# Altium project WPTChargerMain.PrjPcb (part 3 of 3)

## Sheet 06-BatteryManagement.SchDoc: Battery Management
size A2
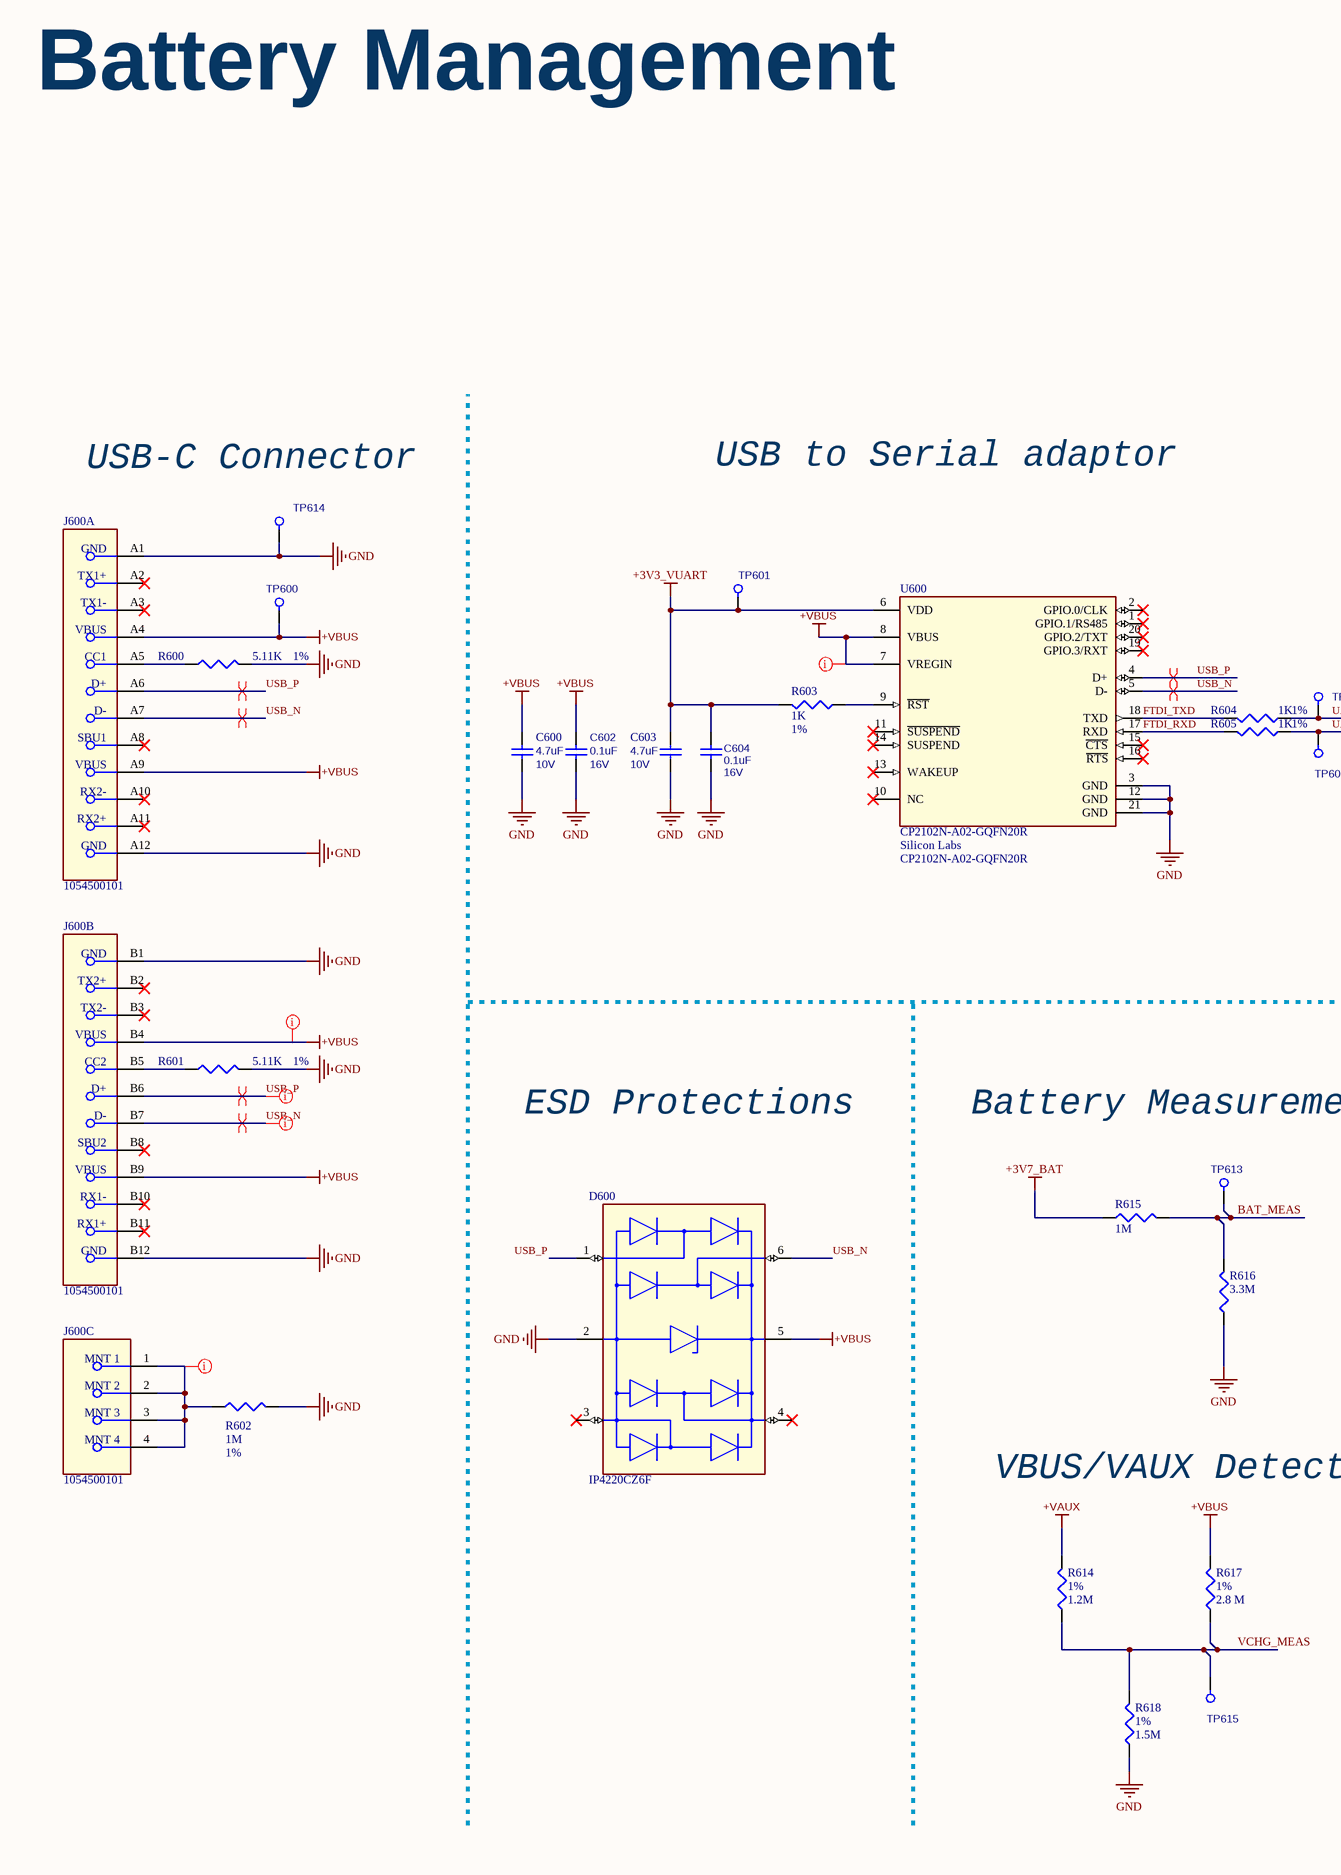
[diagram p6: 06-BatteryManagement.SchDoc, left]
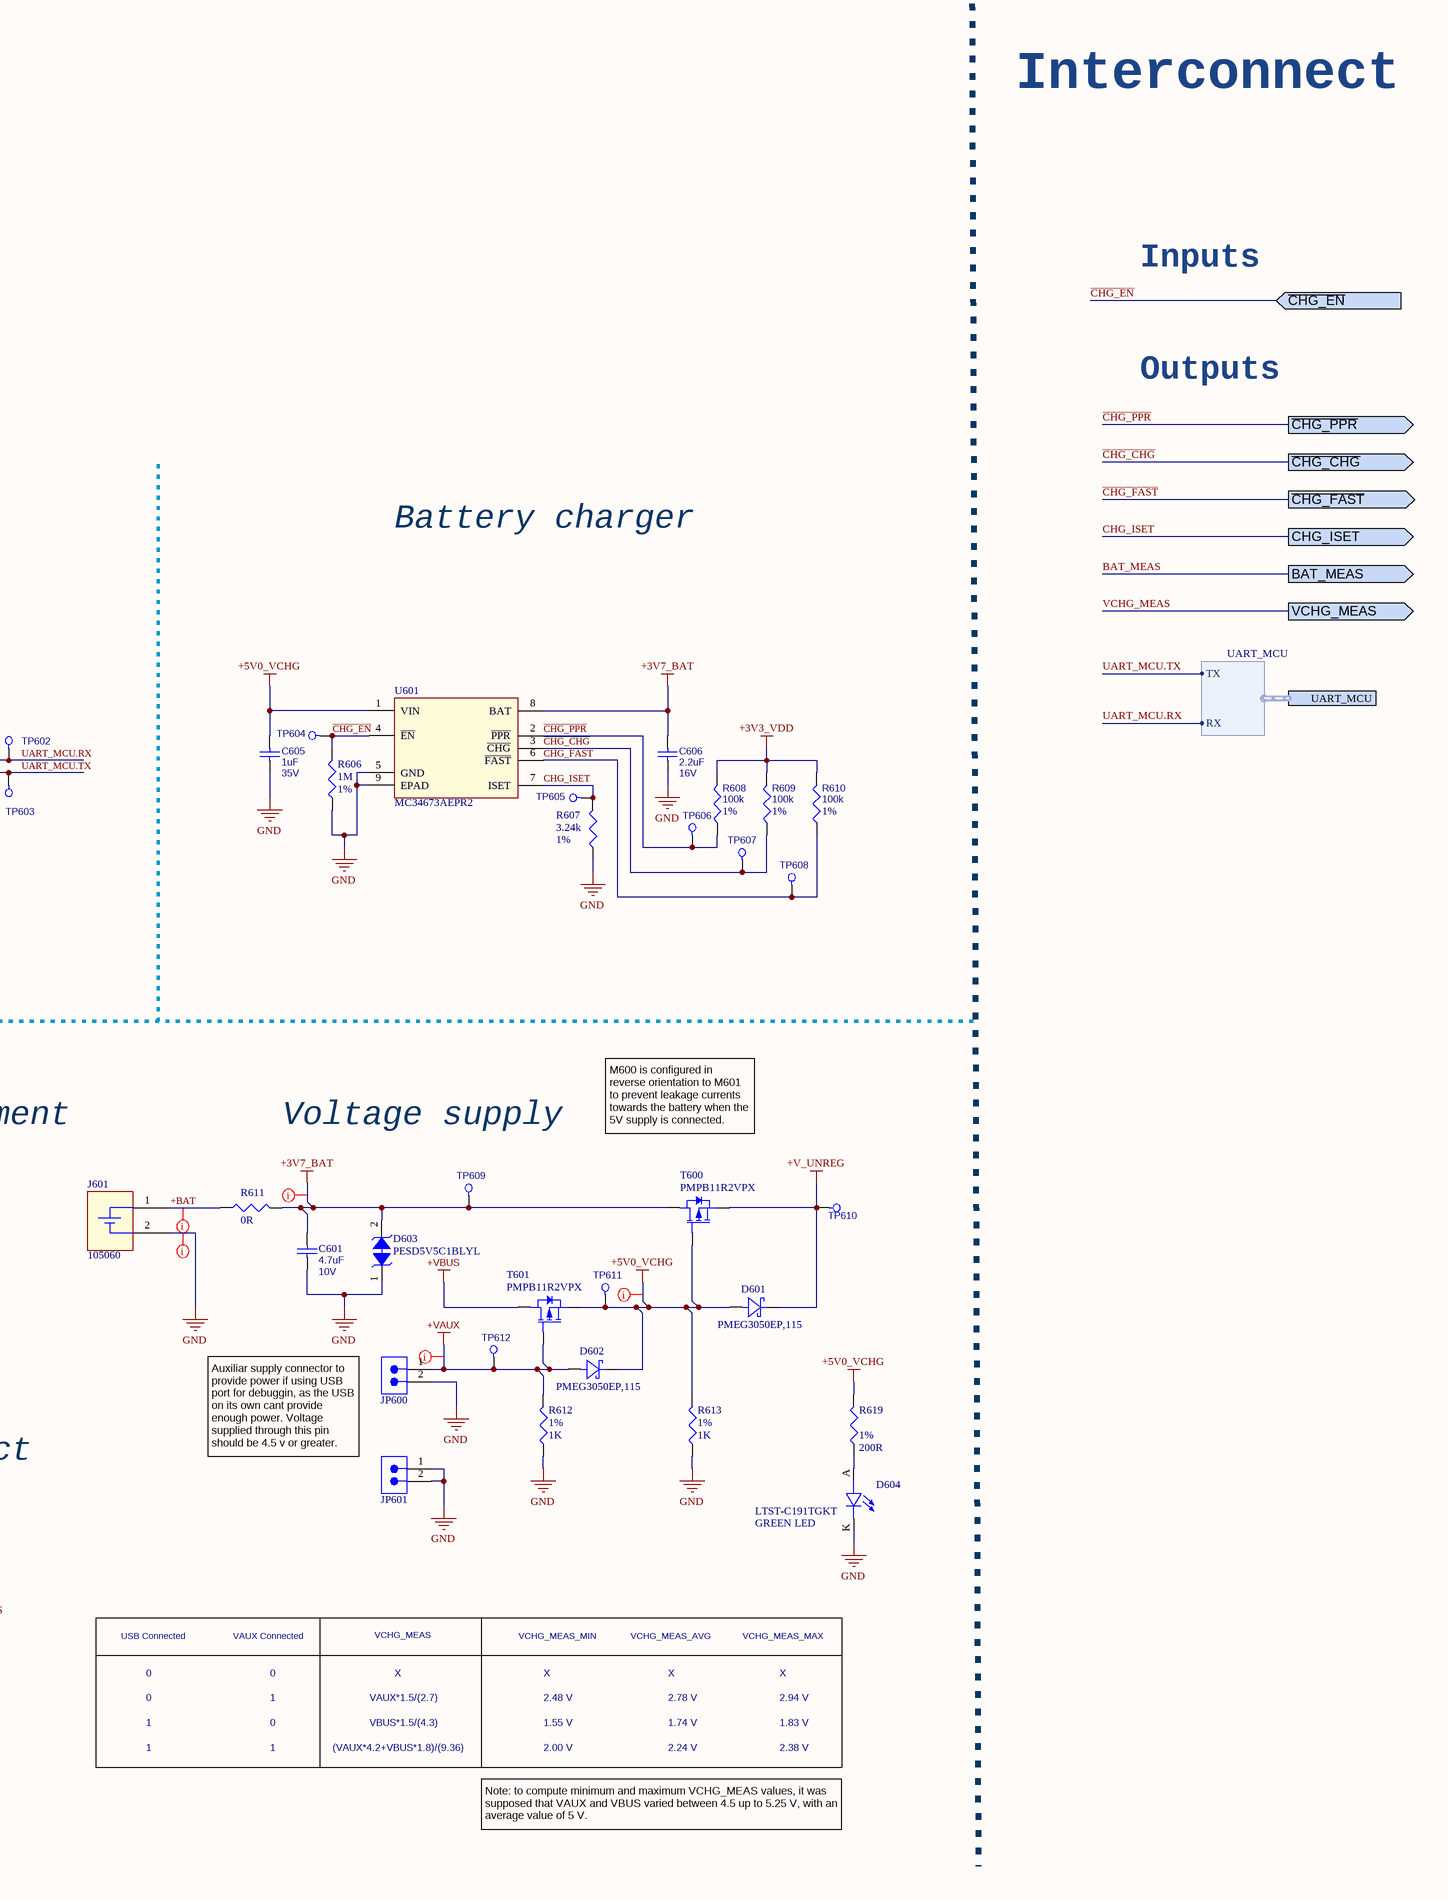
[diagram p7: 06-BatteryManagement.SchDoc, right]

### Parts
C600  value 4.7uF  Rating: 10V  [C0402]  (hidden comment: C1005X5R1A475K050BC)
C601  value 4.7uF  Rating: 10V  [C0402]  (hidden comment: C1005X5R1A475K050BC)
C602  value 0.1uF  Rating: 16V  [C0402]  (hidden comment: GCM155R71C104KA55)
C603  value 4.7uF  Rating: 10V  [C0402]  (hidden comment: C1005X5R1A475K050BC)
C604  value 0.1uF  Rating: 16V  [C0402]  (hidden comment: GCM155R71C104KA55)
C605  value 1uF  Rating: 35V  [C0402]  (hidden comment: GRM155R6YA105KE11D)
C606  value 2.2uF  Rating: 16V  [C0402]  (hidden comment: GRM155R61C225KE44D)
D600  IP4220CZ6F  [FP-SOT457-MFG]
D601  PMEG3050EP,115  [SDO_CFP5_SOD128_NEX-M]
D602  PMEG3050EP,115  [SDO_CFP5_SOD128_NEX-M]
D603  PESD5V5C1BLYL  [PESD5V5C1BLYL]
D604  LTST-C191TGKT  value GREEN LED  [LEDC0603]
J600  1054500101  [FP-1054500101-MFG]  (parts A,B,C of 3)
J601  105060  [BatteryConnector]
JP600  TSW-102-25-G-S-RA  [SAMTEC_TSW-102-25-G-S-RA]  (value not drawn)
JP601  TSW-102-26-G-S  [SMTC-TSW-102-26-XX-S]  (value not drawn)
R600  value 5.11K  Tolerance: 1%  [R0402]  (hidden comment: CRCW04025K11FKEDC)
R601  value 5.11K  Tolerance: 1%  [R0402]  (hidden comment: CRCW04025K11FKEDC)
R602  value 1M  Tolerance: 1%  [R0402]  (hidden comment: CRCW04021M00FKED)
R603  value 1K  Tolerance: 1%  [R0402]  (hidden comment: CRCW04021K00FKED)
R604  value 1K  Tolerance: 1%  [R0402]  (hidden comment: CRCW04021K00FKED)
R605  value 1K  Tolerance: 1%  [R0402]  (hidden comment: CRCW04021K00FKED)
R606  value 1M  Tolerance: 1%  [R0402]  (hidden comment: CRCW04021M00FKED)
R607  value 3.24k  Tolerance: 1%  [R0402]  (hidden comment: CRCW04023K24FKED)
R608  value 100k  Tolerance: 1%  [R0402]  (hidden comment: ERJ-2RKF1003X)
R609  value 100k  Tolerance: 1%  [R0402]  (hidden comment: ERJ-2RKF1003X)
R610  value 100k  Tolerance: 1%  [R0402]  (hidden comment: ERJ-2RKF1003X)
R611  value 0R  [R0805]  (hidden comment: RCS08050000Z0EA)
R612  value 1K  Resistance Tolerance: 1%  [R0402]  (hidden comment: CRCW04021K00FKED)
R613  value 1K  Resistance Tolerance: 1%  [R0402]  (hidden comment: CRCW04021K00FKED)
R614  value 1.2M  Tolerance: 1%  [R0402]  (hidden comment: CRCW04021M20FKEDC)
R615  value 1M  [R0402]  (hidden comment: CRCW04021M00FKED)
R616  value 3.3M  [R0402]  (hidden comment: CRCW04023M30FKED)
R617  value 2.8 M  Tolerance: 1%  [R0402]  (hidden comment: CRCW04022M80FKED)
R618  value 1.5M  Tolerance: 1%  [R0402]  (hidden comment: CRCW04021M50FKED)
R619  value 200R  Tolerance: 1%  [R0402]  (hidden comment: CRCW0402200RFKEDHP)
T600  PMPB11R2VPX  [PMPB11R2VPX]
T601  PMPB11R2VPX  [PMPB11R2VPX]
TP600  Test Point  [testpad_0.9mm]  (value not drawn)  (no BOM)
TP601  Test Point  [testpad_0.9mm]  (value not drawn)  (no BOM)
TP602  Test Point  [testpad_0.9mm]  (value not drawn)  (no BOM)
TP603  Test Point  [testpad_0.9mm]  (value not drawn)  (no BOM)
TP604  Test Point  [testpad_0.9mm]  (value not drawn)  (no BOM)
TP605  Test Point  [testpad_0.9mm]  (value not drawn)  (no BOM)
TP606  Test Point  [testpad_0.9mm]  (value not drawn)  (no BOM)
TP607  Test Point  [testpad_0.9mm]  (value not drawn)  (no BOM)
TP608  Test Point  [testpad_0.9mm]  (value not drawn)  (no BOM)
TP609  Test Point  [testpad_0.9mm]  (value not drawn)  (no BOM)
TP610  Test Point  [testpad_0.9mm]  (value not drawn)  (no BOM)
TP611  Test Point  [testpad_0.9mm]  (value not drawn)  (no BOM)
TP612  Test Point  [testpad_0.9mm]  (value not drawn)  (no BOM)
TP613  Test Point  [testpad_0.9mm]  (value not drawn)  (no BOM)
TP614  Test Point  [testpad_0.9mm]  (value not drawn)  (no BOM)
TP615  Test Point  [testpad_0.9mm]  (value not drawn)  (no BOM)
U600  CP2102N-A02-GQFN20R  Manufacturer: Silicon Labs  [FP-CP2102N-A02-GQFN20R-MFG]
U601  MC34673AEPR2  [SON50P300X60_HS-9M]

### Ports
BAT_MEAS (out), CHG_ISET (out), UART_MCU (harness UART_MCU), VCHG_MEAS (out), ~{CHG_CHG} (out), ~{CHG_EN} (in), ~{CHG_FAST} (out), ~{CHG_PPR} (out)

### Harnesses
UART_MCU: TX, RX

### Nets
+3V3_VDD: R608.2 R609.2 R610.2
+3V3_VUART: C603.1 C604.2 R603.2 TP601.1 U600.6(VDD)
+3V7_BAT: C601.2 C606.2 D603.2(K2) R611.2 R615.1 T600.1,_2,_5,_6,_7(D) TP609.1 U601.8(BAT)
+5V0_VCHG: C605.2 D601.2 D602.1 R613.2 R619.2 T600.3(G) T601.4,_8(S) TP611.1 U601.1(VIN)
+V_UNREG: D601.1 T600.4,_8(S) TP610.1
+VAUX: D602.2 JP600.1 R612.2 R614.2 T601.3(G) TP612.1
+VBUS: C600.1 C602.2 D600.5(VP) J600.A4(VBUS) J600.A9(VBUS) J600.B4(VBUS) J600.B9(VBUS) R617.2 T601.1,_2,_5,_6,_7(D) TP600.1 U600.7(VREGIN) U600.8(VBUS)
GND: C600.2 C601.1 C602.1 C603.2 C604.1 C605.1 C606.1 D600.2(GND) D603.1(K1) D604.K J600.A1(GND) J600.A12(GND) J600.B1(GND) J600.B12(GND) J601.2 JP600.2 JP601.1 JP601.2 R600.2 R601.2 R602.2 R606.1 R607.1 R612.1 R613.1 R616.1 R618.1 TP614.1 U600.3(GND) U600.12(GND) U600.21(GND) U601.5(GND) U601.9(EPAD)
+BAT: J601.1 R611.1
BAT_MEAS: R615.2 R616.2 TP613.1 ; port BAT_MEAS
~{CHG_CHG}: R609.1 TP607.1 U601.3(~{CHG}) ; port ~{CHG_CHG}
~{CHG_EN}: R606.2 TP604.1 U601.4(~{EN}) ; port ~{CHG_EN}
~{CHG_FAST}: R610.1 TP608.1 U601.6(~{FAST}) ; port ~{CHG_FAST}
~{CHG_PPR}: R608.1 TP606.1 U601.2(~{PPR}) ; port ~{CHG_PPR}
CHG_ISET: R607.2 TP605.1 U601.7(ISET) ; port CHG_ISET
FTDI_RXD: R605.2 U600.17(RXD)
FTDI_TXD: R604.2 U600.18(TXD)
UART_MCU.RX: R604.1 TP602.1 ; port UART_MCU.RX
UART_MCU.TX: R605.1 TP603.1 ; port UART_MCU.TX
USB_N: D600.6(I/O4) J600.A7(D-) J600.B7(D-) U600.5(D-)
USB_P: D600.1(I/O1) J600.A6(D+) J600.B6(D+) U600.4(D+)
VCHG_MEAS: R614.1 R617.1 R618.2 TP615.1 ; port VCHG_MEAS
NetD604_A: D604.A R619.1
NetJ600_1: J600.1(MNT_1) J600.2(MNT_2) J600.3(MNT_3) J600.4(MNT_4) R602.1
NetJ600_A5: J600.A5(CC1) R600.1
NetJ600_B5: J600.B5(CC2) R601.1
NetR603_1: R603.1 U600.9(~{RST})

Not connected (* = marked no-connect by the designer): D600 3(I/O2)* 4(I/O3)*; J600 A2(TX1+)* A3(TX1-)* A8(SBU1)* A10(RX2-)* A11(RX2+)* B2(TX2+)* B3(TX2-)* B8(SBU2)* B10(RX1-)* B11(RX1+)*; U600 1(GPIO.1/RS485)* 2(GPIO.0/CLK)* 10(NC)* 11(~{SUSPEND})* 13(WAKEUP)* 14(SUSPEND)* 15(~{CTS})* 16(~{RTS})* 19(GPIO.3/RXT)* 20(GPIO.2/TXT)*

### Layout directives
differential pair: USB_N, USB_P
net class DIGITAL: USB_N, USB_P
rule Supply Nets [Voltage = 5.000]; net class POWER: +VBUS
net class POWER: +VBUS, GND, NetJ600_1
net class POWER; Voltage: 3.7V to 4.2V: +3V7_BAT, +BAT
net class POWER; rule Supply Nets [Voltage = 5.000]: +5V0_VCHG, +VAUX

### Notes on the sheet
- Interconnect
- Battery Management
- Inputs
- Outputs
- USB-C Connector
- USB to Serial adaptor
- Battery charger
- ESD Protections
- Battery Measurement
- Voltage supply
- M600 is configured in reverse orientation to M601 to prevent leakage currents towards the battery when the 5V supply is connected.
- VBUS/VAUX Detect
- Auxiliar supply connector to provide power if using USB port for debuggin, as the USB on its own cant provide enough power. Voltage supplied through this pin should be 4.5 v or greater.
- USB Connected
- 0
- VAUX Connected
- VCHG_MEAS
- X
- VCHG_MEAS_MIN
- VCHG_MEAS_AVG
- VCHG_MEAS_MAX
- 1
- VAUX*1.5/(2.7)
- VBUS*1.5/(4.3)
- 2.48 V
- 1.55 V
- 2.78 V
- 1.74 V
- 2.94 V
- 1.83 V
- (VAUX*4.2+VBUS*1.8)/(9.36)
- 2.00 V
- 2.24 V
- 2.38 V
- Note: to compute minimum and maximum VCHG_MEAS values, it was supposed that VAUX and VBUS varied between 4.5 up to 5.25 V, with an average value of 5 V.
- Project:
- Title:
- Design by:
- Date:
- Ver:
- .
- Comments:
- Reviewed by:

### Library data of the parts
C600 C601 C603 = C1005X5R1A475K050BC: Ceramic Capacitor, Multilayer, Ceramic, 10V, 20% +Tol, 20% -Tol, X5R, 15% TC, 4.7uF, Surface Mount, 0402; Manufacturer: TDK; Multilayer: Yes; Category: Ceramic Capacitors; Supplier 1: Digikey; Supplier Part Number 1: 445-13820-1-ND; Manufacturer Part Number: C1005X5R1A475K050BC; Supplier: Digikey; Supplier Part Number: 445-13820-2-ND; RoHS: Yes; Stock: 569; Pricing: 1=0,3153, 10=0,2364, 25=0,2345, 50=0,1958, 100=0,1492, 250=0,1478, 500=0,0887 (USD); Mounting Technology: Surface Mount; Pins: 2; Dielectric Material: Ceramic; Package Shape: Rectangular; Case/Package: 0402; Terminal Finish: Nickel; Min Operating Temperature: -55°C; Max Operating Temperature: 85°C; JESD-609 Code: e3; Capacitor Type: Ceramic; Tolerance  (fill in as +-): 20%; Package Style: SMTMeter; Packaging: Tape and Reel; Tolerance (fill in as +-): 20%; Temperature Characteristics Code: X5R; Termination: Wraparound; Length: 1mm; Width: 0.5mm; Height: 0.5mm; Reach SVHC Compliant: Yes; RoHS Compliant: Yes; ComponentLink1URL: https://datasheet.ciiva.com:443/pdfs/VipMasterIC/IC/TDKC/TDKC-S-A0008796792/TDKC-S-A0008796792-1.pdf?src-supplier=IHS+Markit; ComponentLink1Description: https://datasheet.ciiva.com:443/pdfs/VipMasterIC/IC/TDKC/TDKC-S-A0008796792/TDKC-S-A0008796792-1.pdf?src-supplier=IHS+Markit; ComponentLink2URL: https://datasheet.ciiva.com/24216/c1005x5r1a475m050bc-264317-24216438.pdf?src-supplier=Mouser; ComponentLink2Description: https://datasheet.ciiva.com/24216/c1005x5r1a475m050bc-264317-24216438.pdf?src-supplier=Mouser; ComponentLink3URL: https://datasheet.ciiva.com/26936/getdatasheetpartid-779544-26936446.pdf?src-supplier=Verical; ComponentLink3Description: https://datasheet.ciiva.com/26936/getdatasheetpartid-779544-26936446.pdf?src-supplier=Verical; ComponentLink4URL: https://datasheet.ciiva.com/23802/1796654-23802733.pdf?src-supplier=Newark; ComponentLink4Description: https://datasheet.ciiva.com/23802/1796654-23802733.pdf?src-supplier=Newark; ComponentLink5URL: https://datasheet.ciiva.com/22719/1796654-22719529.pdf?src-supplier=Element14; ComponentLink5Description: https://datasheet.ciiva.com/22719/1796654-22719529.pdf?src-supplier=Element14; ComponentLink6URL: https://datasheet.ciiva.com/28451/1796654-28451034.pdf?src-supplier=Element14; ComponentLink6Description: https://datasheet.ciiva.com/28451/1796654-28451034.pdf?src-supplier=Element14; ComponentLink7URL: https://datasheet.ciiva.com/22725/1913358-22725448.pdf?src-supplier=Element14; ComponentLink7Description: https://datasheet.ciiva.com/22725/1913358-22725448.pdf?src-supplier=Element14; ComponentLink8URL: https://datasheet.ciiva.com/28665/mlcc-commercial-general-en-28665500.pdf?src-supplier=Element14; ComponentLink8Description: https://datasheet.ciiva.com/28665/mlcc-commercial-general-en-28665500.pdf?src-supplier=Element14; ComponentLink9URL: https://datasheet.ciiva.com/6252/tdkmlcccaprange-6252157.pdf?src-supplier=Digi-Key; ComponentLink9Description: https://datasheet.ciiva.com/6252/tdkmlcccaprange-6252157.pdf?src-supplier=Digi-Key; ComponentLink10URL: https://datasheet.ciiva.com/6252/tdkmlcccaprange-6252150.pdf?src-supplier=Digi-Key; ComponentLink10Description: https://datasheet.ciiva.com/6252/tdkmlcccaprange-6252150.pdf?src-supplier=Digi-Key; ComponentLink11URL: https://datasheet.ciiva.com/24437/986print-detail-pdf-phplangenpart-noc1005x5r1a475m050bcimp-unit-xmhz-24437308.pdf?src-supplier=Onlinecomponents.com; ComponentLink11Description: https://datasheet.ciiva.com/24437/986print-detail-pdf-phplangenpart-noc1005x5r1a475m050bcimp-unit-xmhz-24437308.pdf?src-supplier=Onlinecomponents.com
C602 C604 = GCM155R71C104KA55: Capacitor, 0.1uF, X7R, 16V, 10%, 0402, Implant-grade; Manufacturer: Murata; Medical Grade MFR PN: GCH155R71C104KE01; PCB Footprint: cap0402_reduced; Category: Capacitor; Manufacturer Part Number: GCM155R71C104KA55; Supplier 1: Digikey; Supplier Part Number 1: 490-4759-1-ND; Length (mm): 1.00 ±0.05; Medical Grade MFR: Murata; Thickness (mm): 0.50 ±0.05; Width (mm): 0.50 ±0.05; Package Description: 0402
C605 = GRM155R6YA105KE11D: 1 µF ±10% 35V Ceramic Capacitor X5R 0402 (1005 Metric); Manufacturer: Murata; Length (mm): 1.00 ±0.05; Manufacturer Part Number: GRM155R6YA105KE11D; Thickness (mm): 0.50 ±0.05; Width (mm): 0.50 ±0.05; Category: Capacitor; Package Description: 0402; Supplier 1: Digikey; Supplier Part Number 1: 490-10019-1-ND
C606 = GRM155R61C225KE44D: 2.2 µF ±10% 16V Ceramic Capacitor X5R 0402 (1005 Metric); Manufacturer: Murata; Length (mm): 1.00 ±0.05; Manufacturer Part Number: GRM155R61C225KE44D; Thickness (mm): 0.50 ±0.05; Width (mm): 0.50 ±0.05; Category: Capacitor; Package Description: 0402; Supplier 1: Digikey; Supplier Part Number 1: 490-10455-1-ND
D600 = IP4220CZ6F: TVS DIODE 5.5VWM 6TSOP; Manufacturer: Nexperia; RoHS Compliant: Yes; Manufacturer Part Number: IP4220CZ6F; Supplier 1: Digikey; Supplier Part Number 1: 1727-2751-1-ND
D601 D602 = PMEG3050EP,115: Diode 30 V 5A Surface Mount SOD-128/CFP5; Manufacturer: Nexperia USA Inc.; Forward Voltage: 360mV; Reverse Leakage urrent: 8mA; Reverse Voltage: 50V; Manufacturer Part Number: PMEG3050EP,115; Supplier 1: Digikey; Supplier Part Number 1: 1727-5317-1-ND; Current: 5A; Mounting type: SMD
D603 = PESD5V5C1BLYL: 5.4V (Typ) Clamp 6.5A (8/20µs) Ipp Tvs Diode Surface Mount DFN1006-2; Manufacturer: Nexperia; Voltage breakdown: 7.5V; Mountign type: SMD; Manufacturer Part Number: PESD5V5C1BLYL; Type: TVS; Voltage clamping: 5.4V; Current peak pulse: 6.5A; Package: SOD-882; Supplier 1: Digikey; Supplier Part Number 1: 1727-PESD5V5C1BLYLCT-ND
D604 = LED GREEN CLEAR SMD 0603: LED, GREEN, SMD, 0603, 3.2V, 20mA; Manufacturer: Lite-On Inc.; Power Rating: 76mW; Wavelength: 525nm; Category: LED; Manufacturer Part Number: LTST-C191TGKT; Size Code: 0603; Supplier: Digi-Key; Supplier Part Number: 160-1888-2-ND; Height: 0.55mm; Width: 0.80mm; Length: 1.60mm; Forward Voltage: 3.2V; Forward Current: 20mA; Supplier 1: Digikey; Supplier Part Number 1: 160-1888-2-ND
J600 = CMP-04767-000004-1: CONN RCP USB3.1 TYPEC 24P SMD RA; Manufacturer: Molex; Number Of Contacts: 24; Voltage Rating: 30V; Shielding: true; Is Female: yes; Current Rating: 0.25/1.25/5A; Pitch: 0.5mm; Conn Orientation: Right Angle; Package: 0; Height: 3.44mm; Footprint Url: https://www.molex.com/pdm_docs/sd/1054500101_sd.pdf; Device Class L1: Connectors; Category: Conn; Device Class L2: USB Connectors; Digikey Description: CONN RCP USB3.1 TYPEC 24P SMD RA; Contact Material: Gold,Nickel; Mouser Description: USB Shielded I/O Receptacle; Type C; Right Angle; Surface Mount; Gold over Nickel; ComponentLink2Description: Datasheet; Lead Free: Yes; Automotive: No; Temperature Range High: +85°C; RoHS: TRUE; Octopart: https://octopart.com/105450-0101-molex-68082325; ComponentLink2URL: https://www.molex.com/webdocs/datasheets/pdf/en-us/1054500101_IO_CONNECTORS.pdf; Temperature: -30°C to +85°C; Usb Standard: USB 3.1; Temperature Range Low: -30°C; Device Class L3: unset; Manufacturer Part Number: 1054500101; Supplier 1: Mouser; Supplier Part Number 1: 538-105450-0101
J601 = 105060: Prismatic, 3.7 V Lithium-Ion Battery Rechargeable (Secondary) 4400mAh; Manufacturer: Uline; Voltage: 3.7V; Capacity: 4000mAh; Standard Charge current: 0.8A; Value: Custom Connector; Rapid Charge Current: 2 A; Standard Discharge Current: 80mA; Max Discharge Current: 3000 mA; Minimum Charge Cycles: 300; Manufacturer Part Number: 105060; Size: 50x60x10mm; Category: Li-ion Polymer; Mounting Type: Through hole; Weight: -
JP600 = TSW-102-25-G-S-RA: Conn Unshrouded Header HDR 2 POS 2.54mm 90 degrees Solder ST Thru-Hole; Manufacturer: Samtec; Number of Contacts: 2; Gender: Male; Max Current Rating: 7.6A; Max Voltage Rating (AC): 550V; Orientation: Vertical; ComponentLink3Description: Package Specification; Mounting Technology: Through-hole; ComponentLink2Description: Datasheet; ComponentLink1URL: http://www.samtec.com; DatasheetVersion: F-214; ComponentLink1Description: Manufacturer URL; RoHS: True; ComponentLink2URL: http://www.samtec.com/documents/webfiles/pdf/TSW_TH.PDF; ComponentLink3URL: http://www.samtec.com/documents/webfiles/cpdf/TSW-XXX-XX-XXX-X-XX-XXX-MKT.pdf; Pitch: 2.54 mm; PackageDescription: .025[0.64] SQ. Post Terminal Strip Assembly; PackageVersion: DM, 8/1988; Temperature Range: -55 to 125 degC; Category: Connectors; Contact Plating: Gold; Contact Material: Bronze; Color: Black; Housing Material: Polyester; Contact Shape: Square; Contact Finish - Mating: GOLD; Insulation Color: Black; Insulation Material: PBT; Housing Color: Black; Min Operating Temperature: -55°C; Max Operating Temperature: 125°C; Number of Rows: 1; Packaging: Bulk; Termination: Solder; Number of Positions: 2; Connector Type: Header; Series: TSW; Contact Type: Male Pin; Fastening Type: Pull; Package Quantity: 1; Length: 5.08mm; Width: 2.54mm; Contact Mating Length: 0.23inch; Depth: 2.54mm; Radiation Hardening: No; RoHS Compliant: Yes; Flammability Rating: UL94 V-0; Lead Free: Lead Free; Reach SVHC Compliant: Yes; ComponentLink4URL: https://datasheet.ciiva.com/10281/htsw-th-10281416.pdf?src-supplier=Avnet; ComponentLink4Description: https://datasheet.ciiva.com/10281/htsw-th-10281416.pdf?src-supplier=Avnet; ComponentLink5URL: https://datasheet.ciiva.com/6887/tsw-xxx-xx-xxx-x-xx-xxx-mkt-6887237.pdf?src-supplier=Digi-Key; ComponentLink5Description: https://datasheet.ciiva.com/6887/tsw-xxx-xx-xxx-x-xx-xxx-mkt-6887237.pdf?src-supplier=Digi-Key; Supplier 1: Mouser; Supplier Part Number 1: 200-TSW10225GSRA; Manufacturer Part Number: TSW-102-25-G-S-RA
JP601 = TSW-102-26-G-S: Conn Unshrouded Header HDR 2 POS 2.54mm Solder ST Thru-Hole; Manufacturer: Samtec; Number of Contacts: 2; Gender: Male; Max Current Rating: 7.6A; Max Voltage Rating (AC): 550V; Orientation: Vertical; ComponentLink3Description: Package Specification; PackageReference: TSW-102-26-XX-S; Mounting Technology: Through-hole; ComponentLink2Description: Datasheet; ComponentLink1URL: http://www.samtec.com; DatasheetVersion: F-214; ComponentLink1Description: Manufacturer URL; RoHS: True; ComponentLink2URL: http://www.samtec.com/documents/webfiles/pdf/TSW_TH.PDF; PartNumber: TSW-102-26-G-S; ComponentLink3URL: http://www.samtec.com/documents/webfiles/cpdf/TSW-XXX-XX-XXX-X-XX-XXX-MKT.pdf; Pitch: 2.54 mm; PackageDescription: .025[0.64] SQ. Post Terminal Strip Assembly; PackageVersion: DM, 8/1988; Temperature Range: -55 to 125 degC; Supplier: Newark; Supplier Part Number: 12P1301; Manufacturer Part Number: TSW-102-26-G-S; Category: Connectors; Stock: 3117; Pricing: 1=0.51000, 10=0.47500, 100=0.33200, 500=0.28400, 1000=0.23700, 2500=0.21000, 5000=0.20400 (USD); Contact Plating: Gold; Contact Material: Bronze; Color: Black; Housing Material: Polyester; Contact Shape: Square; Contact Finish - Mating: GOLD; Insulation Color: Black; Insulation Material: PBT; Housing Color: Black; Min Operating Temperature: -55°C; Max Operating Temperature: 125°C; Number of Rows: 1; Packaging: Bulk; Termination: Solder; Number of Positions: 2; Connector Type: Header; Series: TSW; Contact Type: Male Pin; Fastening Type: Pull; Package Quantity: 1; Length: 5.08mm; Width: 2.54mm; Contact Mating Length: 0.23inch; Depth: 2.54mm; Radiation Hardening: No; RoHS Compliant: Yes; Flammability Rating: UL94 V-0; Lead Free: Lead Free; Reach SVHC Compliant: Yes; ComponentLink4URL: https://datasheet.ciiva.com/10281/htsw-th-10281416.pdf?src-supplier=Avnet; ComponentLink4Description: https://datasheet.ciiva.com/10281/htsw-th-10281416.pdf?src-supplier=Avnet; ComponentLink5URL: https://datasheet.ciiva.com/6887/tsw-xxx-xx-xxx-x-xx-xxx-mkt-6887237.pdf?src-supplier=Digi-Key; ComponentLink5Description: https://datasheet.ciiva.com/6887/tsw-xxx-xx-xxx-x-xx-xxx-mkt-6887237.pdf?src-supplier=Digi-Key; Supplier 1: Digikey; Supplier Part Number 1: SAM1077-02-ND
R600 R601 = CRCW04025K11FKEDC: 5.11 kOhms ±1% 0.063W, 1/16W Chip Resistor 0402 (1005 Metric) Thick Film; Manufacturer: Vishay Dale; Temperature Coefficient: 100ppm/°C; Power Rating: 63mW; Voltage Rating (DC): 50V; Packaging: Tape and Reel; Termination: SMD/SMT; Max Operating Temperature: 155°C; Case/Package: 0402; Min Operating Temperature: -55°C; Manufacturer Part Number: CRCW04025K11FKEDC; RoHS: Yes; Category: Chip SMD Resistors; Resistor Type: Thick Film; Construction: Rectangular; Technology: THICK FILM; RoHS Compliant: Yes; ComponentLink1URL: https://datasheet.ciiva.com/11808/0900766b80d98824-11808638.pdf?src-supplier=Rs; ComponentLink1Description: https://datasheet.ciiva.com/11808/0900766b80d98824-11808638.pdf?src-supplier=Rs; ComponentLink2URL: https://datasheet.ciiva.com/2463/dcrcwe3-2463028.pdf?src-supplier=Digi-Key; ComponentLink2Description: https://datasheet.ciiva.com/2463/dcrcwe3-2463028.pdf?src-supplier=Digi-Key; ComponentLink3URL: https://datasheet.ciiva.com/2463/dcrcwe3-2463029.pdf?src-supplier=Digi-Key; ComponentLink3Description: https://datasheet.ciiva.com/2463/dcrcwe3-2463029.pdf?src-supplier=Digi-Key; ComponentLink4URL: https://datasheet.ciiva.com/2463/dcrcwe3-2463030.pdf?src-supplier=Digi-Key; ComponentLink4Description: https://datasheet.ciiva.com/2463/dcrcwe3-2463030.pdf?src-supplier=Digi-Key; ComponentLink5URL: https://datasheet.ciiva.com/26316/fld-crcw-e3-data-en-26316646.pdf?src-supplier=Distrelec; ComponentLink5Description: https://datasheet.ciiva.com/26316/fld-crcw-e3-data-en-26316646.pdf?src-supplier=Distrelec; Supplier 1: Digikey; Supplier Part Number 1: 541-5.11KLCT-ND; Package Quantity: 10; Width: 0.5mm; Military Standard: Not; Length: 1mm; Contact Plating: Tin; Mount: Surface Mount; Case Code (Imperial): 0402; Weight: 2.3E-05oz; Number of Pins: 2; Case Code (Metric): 1005; Lead Free: Lead Free; Number of Terminations: 2; Max Power Dissipation: 63mW; Depth: 0.5mm; Height: 0.35mm; Features: Automotive AEC-Q200; Composition: Thick Film; Radiation Hardening: No; Voltage Rating: 50V; Size Code: 0402; Series: CRCW; Resistance Tolerance: 1%; ComponentLink6URL: https://datasheet.ciiva.com/46385/1697337-46385499.pdf?src-supplier=Element14; ComponentLink6Description: https://datasheet.ciiva.com/46385/1697337-46385499.pdf?src-supplier=Element14; ComponentLink7URL: https://datasheet.ciiva.com/3256/dcrcwe3-3256139.pdf?src-supplier=Avnet; ComponentLink7Description: https://datasheet.ciiva.com/3256/dcrcwe3-3256139.pdf?src-supplier=Avnet; ComponentLink8URL: https://datasheet.ciiva.com/3256/dcrcwe3-3256140.pdf?src-supplier=Avnet; ComponentLink8Description: https://datasheet.ciiva.com/3256/dcrcwe3-3256140.pdf?src-supplier=Avnet; ComponentLink9URL: https://datasheet.ciiva.com/16287/dcrcwe3-16287807.pdf?src-supplier=Future+Electronics; ComponentLink9Description: https://datasheet.ciiva.com/16287/dcrcwe3-16287807.pdf?src-supplier=Future+Electronics
R602 R606 R615 = CRCW04021M00FKED: Res Thick Film 0402 1M Ohm 1% 0.063W(1/16W) ±100ppm/°C Pad SMD Automotive T/R; Manufacturer: Vishay; Power Rating: 63mW; Voltage Rating (DC): 50V; Resistance: 1MR; Category: Chip SMD Resistors; Supplier: Newark; Supplier Part Number: 61M5265; Manufacturer Part Number: CRCW04021M00FKED; RoHS: Yes; Stock: 547467; Pricing: 1=0,12500, 10=0,05300, 25=0,04300, 50=0,03100, 100=0,02100 (USD); Pins: 2; Case/Package: 0402; Min Operating Temperature: -55°C; Max Operating Temperature: 155°C; Resistor Type: Thick Film; Construction: Rectangular; Packaging: Tape and Reel; Technology: THICK FILM; Temperature Coefficient: 100ppm/°C; Termination: SMD/SMT; RoHS Compliant: Yes; ComponentLink1URL: https://datasheet.ciiva.com/11809/0900766b80d98824-11809936.pdf?src-supplier=Rs; ComponentLink1Description: https://datasheet.ciiva.com/11809/0900766b80d98824-11809936.pdf?src-supplier=Rs; ComponentLink2URL: https://datasheet.ciiva.com/2463/dcrcwe3-2463361.pdf?src-supplier=Digi-Key; ComponentLink2Description: https://datasheet.ciiva.com/2463/dcrcwe3-2463361.pdf?src-supplier=Digi-Key; ComponentLink3URL: https://datasheet.ciiva.com/2463/dcrcwe3-2463362.pdf?src-supplier=Digi-Key; ComponentLink3Description: https://datasheet.ciiva.com/2463/dcrcwe3-2463362.pdf?src-supplier=Digi-Key; ComponentLink4URL: https://datasheet.ciiva.com/2463/dcrcwe3-2463363.pdf?src-supplier=Digi-Key; ComponentLink4Description: https://datasheet.ciiva.com/2463/dcrcwe3-2463363.pdf?src-supplier=Digi-Key; ComponentLink5URL: https://datasheet.ciiva.com/3256/dcrcwe3-3256184.pdf?src-supplier=Avnet; ComponentLink5Description: https://datasheet.ciiva.com/3256/dcrcwe3-3256184.pdf?src-supplier=Avnet; ComponentLink6URL: https://datasheet.ciiva.com/3256/dcrcwe3-3256185.pdf?src-supplier=Avnet; ComponentLink6Description: https://datasheet.ciiva.com/3256/dcrcwe3-3256185.pdf?src-supplier=Avnet; ComponentLink7URL: https://datasheet.ciiva.com/5548/dcrcwe3-109170-5548277.pdf?src-supplier=Mouser; ComponentLink7Description: https://datasheet.ciiva.com/5548/dcrcwe3-109170-5548277.pdf?src-supplier=Mouser; ComponentLink8URL: https://datasheet.ciiva.com/16211/dcrcwe3-16211596.pdf?src-supplier=Future+Electronics; ComponentLink8Description: https://datasheet.ciiva.com/16211/dcrcwe3-16211596.pdf?src-supplier=Future+Electronics; ComponentLink9URL: https://datasheet.ciiva.com/16724/70201119-16724238.pdf?src-supplier=Allied+Electronics; ComponentLink9Description: https://datasheet.ciiva.com/16724/70201119-16724238.pdf?src-supplier=Allied+Electronics; ComponentLink10URL: https://datasheet.ciiva.com/7841/1697337-7841486.pdf?src-supplier=Element14; ComponentLink10Description: https://datasheet.ciiva.com/7841/1697337-7841486.pdf?src-supplier=Element14; ComponentLink11URL: https://datasheet.ciiva.com/7841/1697337-7841806.pdf?src-supplier=Element14; ComponentLink11Description: https://datasheet.ciiva.com/7841/1697337-7841806.pdf?src-supplier=Element14; Supplier 1: Newark; Supplier Part Number 1: 61M5265; Lead Free: Lead Free; Case Code (Imperial): 0402; Case Code (Metric): 1005; Number of Terminations: 2; Features: Automotive AEC-Q200; Number of Pins: 2; Max Power Dissipation: 63mW; Height: 0.35mm; Weight: 2.3E-05oz; Package Quantity: 10; Contact Plating: Tin; Radiation Hardening: No; Length: 1mm; Depth: 0.5mm; Voltage Rating: 50V; Composition: Thick Film; Width: 0.02inch; Military Standard: Not; Series: CRCW; Resistance Tolerance: 1%; ComponentLink12URL: https://datasheet.ciiva.com/26316/fld-crcw-e3-data-en-26316602.pdf?src-supplier=Distrelec; ComponentLink12Description: https://datasheet.ciiva.com/26316/fld-crcw-e3-data-en-26316602.pdf?src-supplier=Distrelec; ComponentLink13URL: https://datasheet.ciiva.com/26821/getdatasheetpartid-50834-26821015.pdf?src-supplier=Verical; ComponentLink13Description: https://datasheet.ciiva.com/26821/getdatasheetpartid-50834-26821015.pdf?src-supplier=Verical; ComponentLink14URL: https://datasheet.ciiva.com/16767/70201119-16767639.pdf?src-supplier=Allied+Electronics; ComponentLink14Description: https://datasheet.ciiva.com/16767/70201119-16767639.pdf?src-supplier=Allied+Electronics
  R615: Tolerance: 1%
R603-R605 R612 R613 = CRCW04021K00FKED: Res Thick Film 0402 1K Ohm 1% 1/16W ±100ppm/°C Molded SMD Paper T/R; Manufacturer: Vishay Dale; Resistance: 1kR; Power Rating: 63mW; Voltage Rating (DC): 50V; Category: Chip SMD Resistors; Manufacturer Part Number: CRCW04021K00FKED; RoHS: Yes; Case/Package: 0402; Min Operating Temperature: -55°C; Max Operating Temperature: 155°C; Resistor Type: Thick Film; Construction: Rectangular; Packaging: Tape and Reel; Technology: THICK FILM; Temperature Coefficient: 100ppm/°C; Termination: SMD/SMT; RoHS Compliant: Yes; ComponentLink1URL: https://datasheet.ciiva.com/11808/0900766b80d98824-11808638.pdf?src-supplier=Rs; ComponentLink1Description: https://datasheet.ciiva.com/11808/0900766b80d98824-11808638.pdf?src-supplier=Rs; ComponentLink2URL: https://datasheet.ciiva.com/2463/dcrcwe3-2463028.pdf?src-supplier=Digi-Key; ComponentLink2Description: https://datasheet.ciiva.com/2463/dcrcwe3-2463028.pdf?src-supplier=Digi-Key; ComponentLink3URL: https://datasheet.ciiva.com/2463/dcrcwe3-2463029.pdf?src-supplier=Digi-Key; ComponentLink3Description: https://datasheet.ciiva.com/2463/dcrcwe3-2463029.pdf?src-supplier=Digi-Key; ComponentLink4URL: https://datasheet.ciiva.com/2463/dcrcwe3-2463030.pdf?src-supplier=Digi-Key; ComponentLink4Description: https://datasheet.ciiva.com/2463/dcrcwe3-2463030.pdf?src-supplier=Digi-Key; ComponentLink5URL: https://datasheet.ciiva.com/26316/fld-crcw-e3-data-en-26316646.pdf?src-supplier=Distrelec; ComponentLink5Description: https://datasheet.ciiva.com/26316/fld-crcw-e3-data-en-26316646.pdf?src-supplier=Distrelec; ComponentLink6URL: https://datasheet.ciiva.com/46385/1697337-46385499.pdf?src-supplier=Element14; ComponentLink6Description: https://datasheet.ciiva.com/46385/1697337-46385499.pdf?src-supplier=Element14; ComponentLink7URL: https://datasheet.ciiva.com/3256/dcrcwe3-3256139.pdf?src-supplier=Avnet; ComponentLink7Description: https://datasheet.ciiva.com/3256/dcrcwe3-3256139.pdf?src-supplier=Avnet; ComponentLink8URL: https://datasheet.ciiva.com/3256/dcrcwe3-3256140.pdf?src-supplier=Avnet; ComponentLink8Description: https://datasheet.ciiva.com/3256/dcrcwe3-3256140.pdf?src-supplier=Avnet; ComponentLink9URL: https://datasheet.ciiva.com/16287/dcrcwe3-16287807.pdf?src-supplier=Future+Electronics; ComponentLink9Description: https://datasheet.ciiva.com/16287/dcrcwe3-16287807.pdf?src-supplier=Future+Electronics; Supplier 1: Digikey; Supplier Part Number 1: 541-1.00KLCT-ND; Package Quantity: 10; Width: 0.5mm; Military Standard: Not; Length: 1mm; Contact Plating: Tin; Mount: Surface Mount; Case Code (Imperial): 0402; Weight: 2.3E-05oz; Number of Pins: 2; Case Code (Metric): 1005; Lead Free: Lead Free; Number of Terminations: 2; Max Power Dissipation: 63mW; Depth: 0.5mm; Height: 0.35mm; Features: Automotive AEC-Q200; Composition: Thick Film; Radiation Hardening: No; Voltage Rating: 50V; Stock 1: 8700; Pricing 1: 50=0.03600, 500=0.01400, 1000=0.01200, 2000=0.01000, 4000=0.00900 (GBP); Size Code: 0402; Series: CRCW
  R603-R605: Resistance Tolerance: 1%
  R612 R613: Tolerance: 1%
R607 = CRCW04023K24FKED: 3.24 kOhms ±1% 0.063W, 1/16W Chip Resistor 0402 (1005 Metric) Automotive AEC-Q200 Thick Film; Manufacturer: Vishay Dale; Max Power Dissipation: 63mW; Voltage Rating: 50V; Temperature Coefficient: 100ppm/°C; Termination: SMD/SMT; Case/Package: 0402; Contact Plating: Tin; Number of Pins: 2; Width: 0.5mm; Height: 0.35mm; Case Code (Metric): 1005; Military Standard: Not; Features: Automotive AEC-Q200; Power Rating: 63mW; Lead Free: Lead Free; Depth: 0.5mm; Max Operating Temperature: 155°C; Min Operating Temperature: -55°C; Voltage Rating (DC): 50V; Composition: Thick Film; Mount: Surface Mount; Radiation Hardening: No; Length: 1mm; Number of Terminations: 2; Case Code (Imperial): 0402; Manufacturer Part Number: CRCW04023K24FKED; Supplier 1: Future Electronics; Supplier Part Number 1: 9037818
R608-R610 = ERJ-2RKF1003X: Resistor, 100k, 1%, 0402, Implant-grade; Manufacturer: Panasonic; Medical Grade MFR: Mini-Systems; Medical Grade MFR PN: WA20SM-1003F-NS62TRX; PCB Footprint: res0402_reduced; Rating: 40V; Review: 020823; Length (mm): 1.12 ±0.10; Thickness (mm): 0.33 ±0.08; Width (mm): 0.56 ±0.08; Category: Resistor; Supplier 1: Mouser; Supplier Part Number 1: 667-ERJ-2RKF1003X; Status: Approved; Manufacturer Part Number: ERJ-2RKF1003X
R611 = RCS08050000Z0EA: 0 Ohms Jumper Chip Resistor 0805 (2012 Metric) Automotive AEC-Q200, Pulse Withstanding Thick Film; Manufacturer: Vishay Dale; Power Rating: 500mW; Resistance: 0mR; Voltage Rating (DC): 150V; Depth: 1.25mm; Height: 0.5mm; Number of Pins: 2; Max Operating Temperature: 155°C; Mount: Surface Mount; Radiation Hardening: No; Width: 2mm; Composition: Thick Film; Case/Package: 0805; Min Operating Temperature: -55°C; Termination: SMD/SMT; Manufacturer Part Number: RCS08050000Z0EA; Category: Chip SMD Resistors; ComponentLink1URL: https://datasheet.ciiva.com/11809/0900766b80fcdb72-11809586.pdf?src-supplier=Rs; ComponentLink1Description: https://datasheet.ciiva.com/11809/0900766b80fcdb72-11809586.pdf?src-supplier=Rs; ComponentLink2URL: https://datasheet.ciiva.com/7001/1902866-7001645.pdf?src-supplier=Newark; ComponentLink2Description: https://datasheet.ciiva.com/7001/1902866-7001645.pdf?src-supplier=Newark; ComponentLink3URL: https://datasheet.ciiva.com/7986/691949-7986171.pdf?src-supplier=Element14; ComponentLink3Description: https://datasheet.ciiva.com/7986/691949-7986171.pdf?src-supplier=Element14; ComponentLink4URL: https://datasheet.ciiva.com/7660/1856384-7660956.pdf?src-supplier=Element14; ComponentLink4Description: https://datasheet.ciiva.com/7660/1856384-7660956.pdf?src-supplier=Element14; ComponentLink5URL: https://datasheet.ciiva.com/22693/1902866-22693213.pdf?src-supplier=Element14; ComponentLink5Description: https://datasheet.ciiva.com/22693/1902866-22693213.pdf?src-supplier=Element14; ComponentLink6URL: https://datasheet.ciiva.com/5545/chpreztr-5545708.pdf?src-supplier=Mouser; ComponentLink6Description: https://datasheet.ciiva.com/5545/chpreztr-5545708.pdf?src-supplier=Mouser; ComponentLink7URL: https://datasheet.ciiva.com/16761/70154685-16761515.pdf?src-supplier=Allied+Electronics; ComponentLink7Description: https://datasheet.ciiva.com/16761/70154685-16761515.pdf?src-supplier=Allied+Electronics; ComponentLink8URL: https://datasheet.ciiva.com/30062/159chpreztr-30062601.pdf?src-supplier=Onlinecomponents.com; ComponentLink8Description: https://datasheet.ciiva.com/30062/159chpreztr-30062601.pdf?src-supplier=Onlinecomponents.com; ComponentLink9URL: https://datasheet.ciiva.com/48692/001055497-da-01-en-smd-wid-cr0603-j-000elf-0-0-ohm-1-10w-48692135.pdf?src-supplier=Conrad; ComponentLink9Description: https://datasheet.ciiva.com/48692/001055497-da-01-en-smd-wid-cr0603-j-000elf-0-0-ohm-1-10w-48692135.pdf?src-supplier=Conrad; ComponentLink10URL: https://datasheet.ciiva.com/11811/0900766b80d98b26-11811304.pdf?src-supplier=Rs; ComponentLink10Description: https://datasheet.ciiva.com/11811/0900766b80d98b26-11811304.pdf?src-supplier=Rs; ComponentLink11URL: https://datasheet.ciiva.com/2463/dcrcwe3-2463037.pdf?src-supplier=Digi-Key; ComponentLink11Description: https://datasheet.ciiva.com/2463/dcrcwe3-2463037.pdf?src-supplier=Digi-Key; ComponentLink12URL: https://datasheet.ciiva.com/2463/dcrcwe3-2463038.pdf?src-supplier=Digi-Key; ComponentLink12Description: https://datasheet.ciiva.com/2463/dcrcwe3-2463038.pdf?src-supplier=Digi-Key; ComponentLink13URL: https://datasheet.ciiva.com/2463/dcrcwe3-2463039.pdf?src-supplier=Digi-Key; ComponentLink13Description: https://datasheet.ciiva.com/2463/dcrcwe3-2463039.pdf?src-supplier=Digi-Key; ComponentLink14URL: https://datasheet.ciiva.com/5543/dcrcwe3-109170-5543096.pdf?src-supplier=Mouser; ComponentLink14Description: https://datasheet.ciiva.com/5543/dcrcwe3-109170-5543096.pdf?src-supplier=Mouser; ComponentLink15URL: https://datasheet.ciiva.com/16389/dcrcwe3-16389338.pdf?src-supplier=Future+Electronics; ComponentLink15Description: https://datasheet.ciiva.com/16389/dcrcwe3-16389338.pdf?src-supplier=Future+Electronics; ComponentLink16URL: https://datasheet.ciiva.com/7841/1697337-7841629.pdf?src-supplier=Element14; ComponentLink16Description: https://datasheet.ciiva.com/7841/1697337-7841629.pdf?src-supplier=Element14; ComponentLink17URL: https://datasheet.ciiva.com/7841/1720486-7841839.pdf?src-supplier=Element14; ComponentLink17Description: https://datasheet.ciiva.com/7841/1720486-7841839.pdf?src-supplier=Element14; ComponentLink18URL: https://datasheet.ciiva.com/26314/fld-crcw-e3-data-en-26314630.pdf?src-supplier=Distrelec; ComponentLink18Description: https://datasheet.ciiva.com/26314/fld-crcw-e3-data-en-26314630.pdf?src-supplier=Distrelec; ComponentLink19URL: https://datasheet.ciiva.com/16719/70201119-16719706.pdf?src-supplier=Allied+Electronics; ComponentLink19Description: https://datasheet.ciiva.com/16719/70201119-16719706.pdf?src-supplier=Allied+Electronics; Supplier 1: Digikey; Supplier Part Number 1: 541-2827-1-ND
R614 = CRCW04021M20FKEDC: Resistor, 1.2 M 1%, 0402; Manufacturer: Vishay; Power: 63 mW; Temperature Coefficient: 100 ppm/°C; Voltage Rating: 50V; Category: Resistor; Manufacturer Part Number: CRCW04021M20FKEDC; Medical Grade Manufacturer: -; Medical Grade Manufacturer Part Number: -; Size Code: 0402; Supplier: TBD; Supplier Part Number: TBD; Height: 0.35mm; Width: 0.5mm; Length: 1mm; Supplier 1: Mouser; Supplier Part Number 1: 71-CRCW04021M20FKEDC; Supplier 2: Digikey; Supplier Part Number 2: 541-4796-2-ND
R616 = CRCW04023M30FKED: 3.3 MOhms ±1% 0.063W, 1/16W Chip Resistor 0402 (1005 Metric) Automotive AEC-Q200 Thick Film; Manufacturer: Vishay; Power Rating: 63mW; Temperature Coefficient: 100ppm/°C; Voltage Rating: 50V; Min Operating Temperature: -55°C; Lead Free: Lead Free; Case Code (Imperial): 0402; Tolerance: 1%; Max Power Dissipation: 63mW; Height: 0.35mm; Contact Plating: Tin; Length: 1mm; Case/Package: 0402; Max Operating Temperature: 155°C; Manufacturer Part Number: CRCW04023M30FKED; RoHS: Yes; Category: Chip SMD Resistors; Pins: 2; Series: CRCW; Resistance Tolerance: 1%; ComponentLink1URL: https://datasheet.ciiva.com/11809/0900766b80d98824-11809936.pdf?src-supplier=Rs; ComponentLink1Description: https://datasheet.ciiva.com/11809/0900766b80d98824-11809936.pdf?src-supplier=Rs; ComponentLink2URL: https://datasheet.ciiva.com/2463/dcrcwe3-2463361.pdf?src-supplier=Digi-Key; ComponentLink2Description: https://datasheet.ciiva.com/2463/dcrcwe3-2463361.pdf?src-supplier=Digi-Key; ComponentLink3URL: https://datasheet.ciiva.com/2463/dcrcwe3-2463362.pdf?src-supplier=Digi-Key; ComponentLink3Description: https://datasheet.ciiva.com/2463/dcrcwe3-2463362.pdf?src-supplier=Digi-Key; ComponentLink4URL: https://datasheet.ciiva.com/2463/dcrcwe3-2463363.pdf?src-supplier=Digi-Key; ComponentLink4Description: https://datasheet.ciiva.com/2463/dcrcwe3-2463363.pdf?src-supplier=Digi-Key; ComponentLink5URL: https://datasheet.ciiva.com/3256/dcrcwe3-3256184.pdf?src-supplier=Avnet; ComponentLink5Description: https://datasheet.ciiva.com/3256/dcrcwe3-3256184.pdf?src-supplier=Avnet; ComponentLink6URL: https://datasheet.ciiva.com/3256/dcrcwe3-3256185.pdf?src-supplier=Avnet; ComponentLink6Description: https://datasheet.ciiva.com/3256/dcrcwe3-3256185.pdf?src-supplier=Avnet; ComponentLink7URL: https://datasheet.ciiva.com/5548/dcrcwe3-109170-5548277.pdf?src-supplier=Mouser; ComponentLink7Description: https://datasheet.ciiva.com/5548/dcrcwe3-109170-5548277.pdf?src-supplier=Mouser; ComponentLink8URL: https://datasheet.ciiva.com/16211/dcrcwe3-16211596.pdf?src-supplier=Future+Electronics; ComponentLink8Description: https://datasheet.ciiva.com/16211/dcrcwe3-16211596.pdf?src-supplier=Future+Electronics; ComponentLink9URL: https://datasheet.ciiva.com/16724/70201119-16724238.pdf?src-supplier=Allied+Electronics; ComponentLink9Description: https://datasheet.ciiva.com/16724/70201119-16724238.pdf?src-supplier=Allied+Electronics; ComponentLink10URL: https://datasheet.ciiva.com/7841/1697337-7841486.pdf?src-supplier=Element14; ComponentLink10Description: https://datasheet.ciiva.com/7841/1697337-7841486.pdf?src-supplier=Element14; ComponentLink11URL: https://datasheet.ciiva.com/7841/1697337-7841806.pdf?src-supplier=Element14; ComponentLink11Description: https://datasheet.ciiva.com/7841/1697337-7841806.pdf?src-supplier=Element14; ComponentLink12URL: https://datasheet.ciiva.com/26316/fld-crcw-e3-data-en-26316602.pdf?src-supplier=Distrelec; ComponentLink12Description: https://datasheet.ciiva.com/26316/fld-crcw-e3-data-en-26316602.pdf?src-supplier=Distrelec; ComponentLink13URL: https://datasheet.ciiva.com/26821/getdatasheetpartid-50834-26821015.pdf?src-supplier=Verical; ComponentLink13Description: https://datasheet.ciiva.com/26821/getdatasheetpartid-50834-26821015.pdf?src-supplier=Verical; ComponentLink14URL: https://datasheet.ciiva.com/16767/70201119-16767639.pdf?src-supplier=Allied+Electronics; ComponentLink14Description: https://datasheet.ciiva.com/16767/70201119-16767639.pdf?src-supplier=Allied+Electronics; Supplier 1: Digikey; Supplier Part Number 1: 541-3.30MLCT-ND
R617 = CRCW04022M80FKED: Resistor, 2.8 M 1%, 0402; Manufacturer: Vishay; Medical Grade Manufacturer: TBD; Power: 62.5mW; Temperature Coefficient: 100 ppm/°C; Voltage Rating: 50V; Category: Resistor; Manufacturer Part Number: CRCW04022M80FKED; Medical Grade Manufacturer Part Number: TBD; Size Code: 0402; Supplier: -; Supplier Part Number: -; Height: 0.35mm; Width: 0.5mm; Length: 1mm; Supplier 1: Mouser; Supplier Part Number 1: 71-CRCW04022M80FKED; Supplier 2: Digikey; Supplier Part Number 2: 541-2.80MLCT-ND; Supplier 3: Digikey; Supplier Part Number 3: 541-2.80MLDKR-ND; Supplier 4: Digikey; Supplier Part Number 4: 541-2.80MLTR-ND
R618 = CRCW04021M50FKED: Resistor, 1.5 M 1%, 0402; Manufacturer: Vishay; Power: 62.5mW; Temperature Coefficient: 100 ppm/°C; Voltage Rating: 50V; Category: Resistor; Manufacturer Part Number: CRCW04021M50FKED; Medical Grade Manufacturer: -; Medical Grade Manufacturer Part Number: -; Size Code: 0402; Supplier: TBD; Supplier Part Number: TBD; Height: 0.35mm; Width: 0.5mm; Length: 1mm; Supplier 1: Mouser; Supplier Part Number 1: 71-CRCW04021M50FKED; Supplier 2: Digikey; Supplier Part Number 2: 541-1.50MLCT-ND; Supplier 3: Digikey; Supplier Part Number 3: 541-1.50MLDKR-ND; Supplier 4: Digikey; Supplier Part Number 4: 541-1.50MLTR-ND
R619 = CRCW0402200RFKEDHP: Resistor 200 1%, 0402, Non Implant-grade; Manufacturer: Vishay; Medical Grade Manufacturer: None; Power: 200 mW; Temperature Coefficient: 100 ppm/°C; Voltage Rating: 50V; Category: Resistor; Manufacturer Part Number: CRCW0402200RFKEDHP; Medical Grade Manufacturer Part Number: None; Size Code: 0402; Supplier: TBD; Supplier Part Number: TBD; Height: 0.3mm; Width: 0.5mm; Length: 1mm; Supplier 1: Mouser; Supplier Part Number 1: 71-CRCW0402200RFKEDH; Supplier 2: Digikey; Supplier Part Number 2: 541-200YCT-ND; Supplier 3: Digikey; Supplier Part Number 3: 541-200YDKR-ND; Supplier 4: Digikey; Supplier Part Number 4: 541-200YTR-ND
T600 T601 = PMPB11R2VPX: MOSFET, technology, P-MOS, 1 Channel, Vgs th 0.9 max, 1.9 W, SMD; Manufacturer: Nexperia; Number of Channels: 1; Power Dissipation: 1.9 W; Id, drain  DC current max: 14 A; Vds breakdown: 12 V; Vgs max: 8 V; Vgs th: 0.9 V; Category: Transistor; Type: P-MOS; Supplier: TBD; Supplier Part Number: TBD; Mounting Type: SMD; Height: 0.65mm; Rds On: *; Manufacturer Part Number: PMPB11R2VPX; Supplier 1: Mouser; Supplier Part Number 1: 771-PMPB11R2VPX; Supplier 2: Digikey; Supplier Part Number 2: 1727-PMPB11R2VPXTR-ND
TP600-TP615 = Test Point: Test pad, 0.90mm circular pad; PCB Footprint: testpad_0p90mm; Length (mm): 0.90; Manufacturer: N/A; Manufacturer PN: N/A; Medical Grade MFR: N/A; Medical Grade MFR PN: N/A; Rating: N/A; Thickness (mm): N/A; Value: Test point; Width (mm): 0.90; Category: Test point; Status: *; Review: *
U600 = CP2102N-A02-GQFN20R: IC USB TO UART BRIDGE QFN20; Supplier 1: Mouser; Supplier Part Number 1: 634-CP2102NA02QFN20R; Value: CP2102N-A02-GQFN20R; Manufacturer Part Number: CP2102N-A02-GQFN20R
U601 = MC34673AEPR2: Battery Charger Li-Ion/Li-Pol 1200mA 4.2V 8-Pin UDFN T/R; Manufacturer: NXP Semiconductors; Check_prices: https://www.snapeda.com/parts/MC34673AEPR2/NXP+Semiconductors/view-part/?ref=eda; Value: *; Availability: In Stock; Price: None; Package: None; SnapEDA_Link: https://www.snapeda.com/parts/MC34673AEPR2/NXP+Semiconductors/view-part/?ref=snap; Purchase-URL: https://pricing.snapeda.com/search/part/MC34673AEPR2/?ref=eda; Supplier 1: Digikey; Supplier Part Number 1: MC34673AEPR2CT-ND; Manufacturer Part Number: MC34673AEPR2

## Nets that join several sheets
+3V3_VDD: 03-MCU (20 pins), 04-WPT-IC (5 pins), 05-PMC (R500.2 R504.2 TP500.1), 06-BatteryManagement (R608.2 R609.2 R610.2)
+5V0_VCC: 03-MCU (C324.2 C326.2 U300.2 U302.5), 04-WPT-IC (10 pins), 05-PMC (R503.2 TP501.1)
+V_UNREG: 03-MCU (6 pins), 05-PMC (6 pins), 06-BatteryManagement (D601.1 T600.4, 8 TP610.1)
GND: 03-MCU (48 pins), 04-WPT-IC (29 pins), 05-PMC (11 pins), 06-BatteryManagement (33 pins)
BAT_MEAS: 03-MCU (U301.41), 06-BatteryManagement (R615.2 R616.2 TP613.1)
~{CHG_CHG}: 03-MCU (U301.21), 06-BatteryManagement (R609.1 TP607.1 U601.3)
~{CHG_EN}: 03-MCU (U301.29), 06-BatteryManagement (R606.2 TP604.1 U601.4)
~{CHG_FAST}: 03-MCU (U301.30), 06-BatteryManagement (R610.1 TP608.1 U601.6)
~{CHG_PPR}: 03-MCU (U301.20), 06-BatteryManagement (R608.1 TP606.1 U601.2)
CHG_ISET: 03-MCU (U301.40), 06-BatteryManagement (R607.2 TP605.1 U601.7)
DAC_~{LDAC}: 03-MCU (U301.11), 04-WPT-IC (TP413.1 U401.11)
DAC_REF: 03-MCU (U301.44), 04-WPT-IC (C412.2 TP406.1 U401.1)
SPI.~{CS}: 03-MCU (U301.10), 04-WPT-IC (TP411.1 U401.12)
SPI.SCLK: 03-MCU (U301.9), 04-WPT-IC (TP405.1 U401.13)
SPI.SDIN: 03-MCU (U301.8), 04-WPT-IC (TP404.1 U401.14)
SPI.SDO: 03-MCU (U301.7), 04-WPT-IC (R413.2 TP412.1 U401.15)
UART_MCU.RX: 03-MCU (U301.23), 06-BatteryManagement (R604.1 TP602.1)
UART_MCU.TX: 03-MCU (U301.22), 06-BatteryManagement (R605.1 TP603.1)
VCC_EN: 03-MCU (U301.19), 05-PMC (TP502.1 U501.2)
VCHG_MEAS: 03-MCU (U301.39), 06-BatteryManagement (R614.1 R617.1 R618.2 TP615.1)
WPT_CTD_CTRL: 03-MCU (U301.5), 04-WPT-IC (M400.1 TP409.1)
WPT_~{EN}: 03-MCU (U300.1), 04-WPT-IC (R403.1 TP400.1 U400.15)
WPT_IMON: 03-MCU (U301.42), 04-WPT-IC (C406.2 R401.2 TP419.1 U400.5)
WPT_NTC: 03-MCU (U301.43), 04-WPT-IC (5 pins)
WPT_STAT: 03-MCU (U302.4), 04-WPT-IC (R410.1 TP417.1 U400.8)

## Assembly variants
WPTChargerMain: not fitted C321 C322 J301 J601 J601 JP400 JP601 L400 NTC400 R404 R413